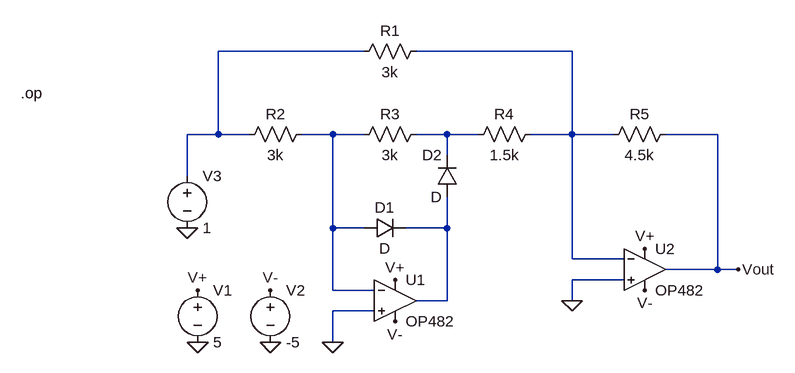
[diagram p0: schematic ET4OP.asc]
ET4OP.asc, the LTspice schematic file:
Version 4.1
SHEET 1 1144 760
WIRE 496 272 272 272
WIRE 816 272 576 272
WIRE 272 400 272 272
WIRE 272 400 224 400
WIRE 320 400 272 400
WIRE 448 400 400 400
WIRE 496 400 448 400
WIRE 624 400 576 400
WIRE 672 400 624 400
WIRE 816 400 816 272
WIRE 816 400 752 400
WIRE 880 400 816 400
WIRE 1040 400 960 400
WIRE 624 432 624 400
WIRE 224 464 224 400
WIRE 448 544 448 400
WIRE 496 544 448 544
WIRE 624 544 624 496
WIRE 624 544 560 544
WIRE 816 592 816 400
WIRE 896 592 816 592
WIRE 1040 608 1040 400
WIRE 1040 608 960 608
WIRE 1072 608 1040 608
WIRE 896 624 816 624
WIRE 448 640 448 544
WIRE 512 640 448 640
WIRE 624 656 624 544
WIRE 624 656 576 656
WIRE 816 656 816 624
WIRE 512 672 448 672
WIRE 448 720 448 672
FLAG 816 656 0
FLAG 1072 608 Vout
FLAG 240 720 0
FLAG 352 720 0
FLAG 240 640 V+
FLAG 352 640 V-
FLAG 928 576 V+
FLAG 928 640 V-
FLAG 544 624 V+
FLAG 544 688 V-
FLAG 448 720 0
FLAG 224 544 0
SYMBOL res 592 256 R90
WINDOW 0 0 56 VBottom 2
WINDOW 3 32 56 VTop 2
SYMATTR InstName R1
SYMATTR Value 3k
SYMBOL res 416 384 R90
WINDOW 0 0 56 VBottom 2
WINDOW 3 32 56 VTop 2
SYMATTR InstName R2
SYMATTR Value 3k
SYMBOL res 592 384 R90
WINDOW 0 0 56 VBottom 2
WINDOW 3 32 56 VTop 2
SYMATTR InstName R3
SYMATTR Value 3k
SYMBOL res 768 384 R90
WINDOW 0 0 56 VBottom 2
WINDOW 3 32 56 VTop 2
SYMATTR InstName R4
SYMATTR Value 1.5k
SYMBOL res 976 384 R90
WINDOW 0 0 56 VBottom 2
WINDOW 3 32 56 VTop 2
SYMATTR InstName R5
SYMATTR Value 4.5k
SYMBOL OpAmps\\OP482 544 592 R0
SYMATTR InstName U1
SYMBOL OpAmps\\OP482 928 544 R0
SYMATTR InstName U2
SYMBOL voltage 240 624 R0
WINDOW 123 0 0 Left 0
WINDOW 39 0 0 Left 0
SYMATTR InstName V1
SYMATTR Value 5
SYMBOL voltage 352 624 R0
SYMATTR InstName V2
SYMATTR Value -5
SYMBOL diode 640 496 R180
WINDOW 0 24 64 Left 2
WINDOW 3 24 0 Left 2
SYMATTR InstName D2
SYMBOL diode 496 560 R270
WINDOW 0 32 32 VTop 2
WINDOW 3 0 32 VBottom 2
SYMATTR InstName D1
SYMBOL voltage 224 448 R0
WINDOW 123 0 0 Left 0
WINDOW 39 0 0 Left 0
SYMATTR InstName V3
SYMATTR Value 1
TEXT -32 336 Left 2 !.op

The netlist it stands for:
* ET4OP.asc
R1 N002 N001 3k
R2 N003 N001 3k
R3 N004 N003 3k
R4 N002 N004 1.5k
R5 Vout N002 4.5k
X§U1 0 N003 V+ V- N005 OP482  ; pins In+ In- V+ V- OUT
X§U2 0 N002 V+ V- Vout OP482  ; pins In+ In- V+ V- OUT
V1 V+ 0 5
V2 V- 0 -5
D2 N005 N004 D
D1 N003 N005 D
V3 N001 0 1
.model D D
.lib standard.dio
.op
.backanno
.end